# EAGLE design io_shield (EAGLE 9.6.2)
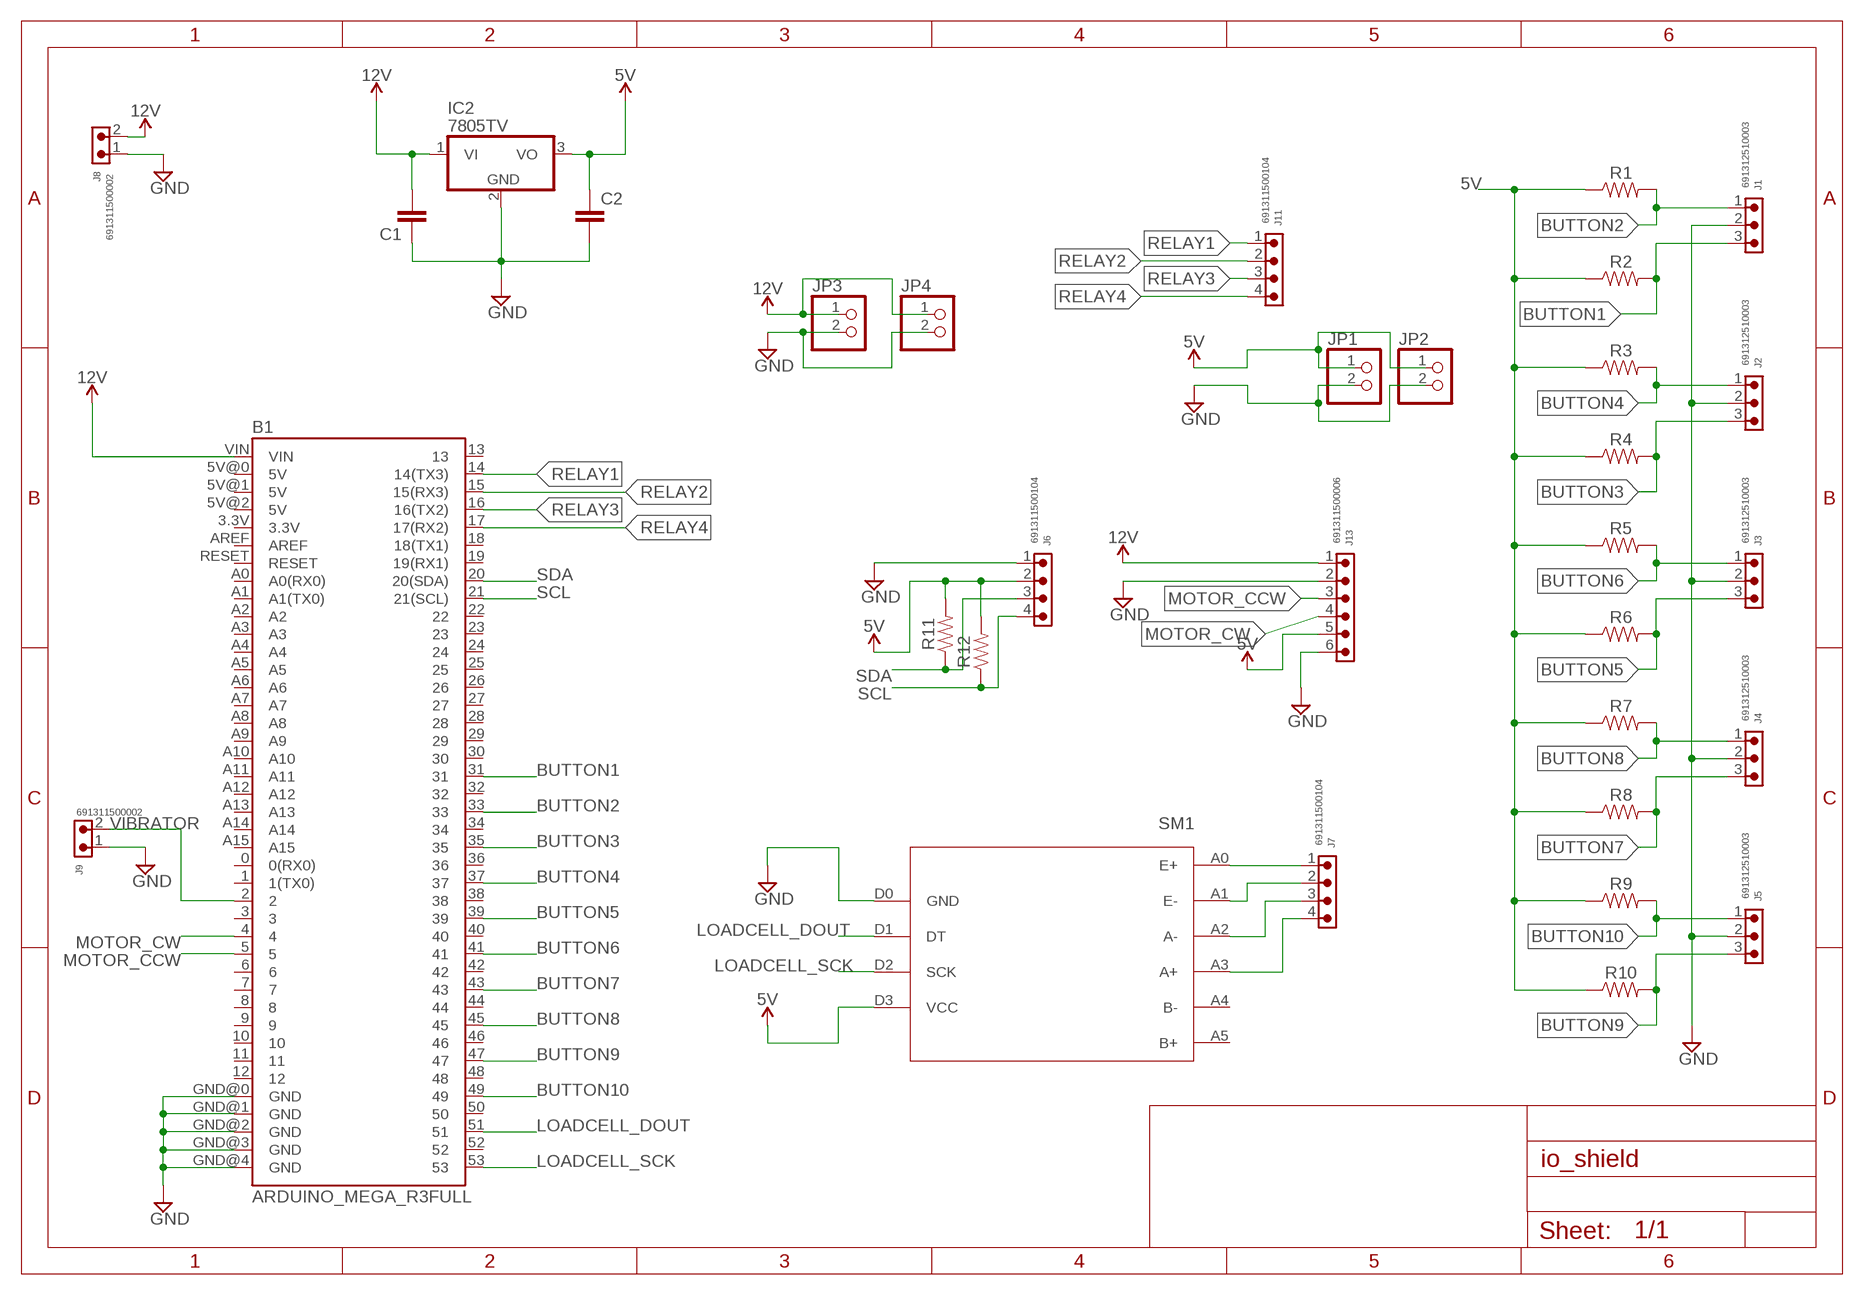
[diagram p0: schematic, sheet 1]

## Parts
B1  ARDUINO_MEGA_R3FULL  [ARDUINO_MEGA]
C1  C-EU050-025X075  [C050-025X075]
C2  C-EU050-025X075  [C050-025X075]
IC2  7805TV  [TO220V]
J1  691312510003  691312510003  [691312510003]
J2  691312510003  691312510003  [691312510003]
J3  691312510003  691312510003  [691312510003]
J4  691312510003  691312510003  [691312510003]
J5  691312510003  691312510003  [691312510003]
J6  691311500104  691311500104  [691311500104]
J7  691311500104  691311500104  [691311500104]
J8  691311500002  691311500002  [691311500002]
J9  691311500002  691311500002  [691311500002]
J11  691311500104  691311500104  [691311500104]
J13  691311500006  691311500006  [691311500006]
JP1  PINHD-1X2  [1X02]
JP2  PINHD-1X2  [1X02]
JP3  PINHD-1X2  [1X02]
JP4  PINHD-1X2  [1X02]
R1  RESISTORAXIAL-0.3  [AXIAL-0.3]
R2  RESISTORAXIAL-0.3  [AXIAL-0.3]
R3  RESISTORAXIAL-0.3  [AXIAL-0.3]
R4  RESISTORAXIAL-0.3  [AXIAL-0.3]
R5  RESISTORAXIAL-0.3  [AXIAL-0.3]
R6  RESISTORAXIAL-0.3  [AXIAL-0.3]
R7  RESISTORAXIAL-0.3  [AXIAL-0.3]
R8  RESISTORAXIAL-0.3  [AXIAL-0.3]
R9  RESISTORAXIAL-0.3  [AXIAL-0.3]
R10  RESISTORAXIAL-0.3  [AXIAL-0.3]
R11  RESISTORAXIAL-0.3  [AXIAL-0.3]
R12  RESISTORAXIAL-0.3  [AXIAL-0.3]
SM1  HX711  [HX711]

## Nets
5V: C2.1 IC2.3(VO) J6.2 J13.5 JP1.1 JP2.1 R1.P$1 R2.P$1 R3.P$1 R4.P$1 R5.P$1 R6.P$1 R7.P$1 R8.P$1 R9.P$1 R10.P$1 R11.P$2 R12.P$2 SM1.D3(VCC)
12V: B1.VIN C1.2 IC2.1(VI) J8.2 J13.1 JP3.1 JP4.1
A+: J7.4 SM1.A3(A+)
A-: J7.3 SM1.A2(A-)
BUTTON1: B1.31 J1.3 R2.P$2
BUTTON2: B1.33 J1.1 R1.P$2
BUTTON3: B1.35 J2.3 R4.P$2
BUTTON4: B1.37 J2.1 R3.P$2
BUTTON5: B1.39 J3.3 R6.P$2
BUTTON6: B1.41 J3.1 R5.P$2
BUTTON7: B1.43 J4.3 R8.P$2
BUTTON8: B1.45 J4.1 R7.P$2
BUTTON9: B1.47 J5.3 R10.P$2
BUTTON10: B1.49 J5.1 R9.P$2
E+: J7.1 SM1.A0(E+)
E-: J7.2 SM1.A1(E-)
GND: B1.GND@0(GND) B1.GND@1(GND) B1.GND@2(GND) B1.GND@3(GND) B1.GND@4(GND) C1.1 C2.2 IC2.2(GND) J1.2 J2.2 J3.2 J4.2 J5.2 J6.1 J8.1 J9.1 J13.2 J13.6 JP1.2 JP2.2 JP3.2 JP4.2 SM1.D0(GND)
LOADCELL_DOUT: B1.51 SM1.D1(DT)
LOADCELL_SCK: B1.53 SM1.D2(SCK)
MOTOR_CCW: B1.5 J13.3
MOTOR_CW: B1.4 J13.4
RELAY1: B1.14(14(TX3)) J11.1
RELAY2: B1.15(15(RX3)) J11.2
RELAY3: B1.16(16(TX2)) J11.3
RELAY4: B1.17(17(RX2)) J11.4
SCL: B1.21(21(SCL)) J6.4 R12.P$1
SDA: B1.20(20(SDA)) J6.3 R11.P$1
VIBRATOR: B1.2 J9.2
Unconnected: B1.0(0(RX0)) B1.1(1(TX0)) B1.3 B1.3.3V B1.5V@0(5V) B1.5V@1(5V) B1.5V@2(5V) B1.6 B1.7 B1.8 B1.9 B1.10 B1.11 B1.12 B1.13 B1.18(18(TX1)) B1.19(19(RX1)) B1.22 B1.23 B1.24 B1.25 B1.26 B1.27 B1.28 B1.29 B1.30 B1.32 B1.34 B1.36 B1.38 B1.40 B1.42 B1.44 B1.46 B1.48 B1.50 B1.52 B1.A0(A0(RX0)) B1.A1(A1(TX0)) B1.A2 B1.A3 B1.A4 B1.A5 B1.A6 B1.A7 B1.A8 B1.A9 B1.A10 B1.A11 B1.A12 B1.A13 B1.A14 B1.A15 B1.AREF B1.RESET SM1.A4(B-) SM1.A5(B+)

## Library data of the parts
B1 = SparkFun-Boards:ARDUINO_MEGA_R3: Arduino Mega R3 ATmega2560 R3 compatible footprint. SparkFun Products: Arduino Mega 2560 R3 <https://www.sparkfun.com/products/11061>
C1 C2 = rcl:C-EU: CAPACITOR, European symbol; SPICEPREFIX: C
IC2 = linear:78*: Positive VOLTAGE REGULATOR Source: http://cache.national.com/ds/LM/LM78L05.pdf http://www.fairchildsemi.com/ds/LM/LM7805.pdf
J1-J5 = Eagle_WR-TBL Pluggable Connector (rev20b) (1):691312510003: WR-TBL Serie 312 - 5.08 mm Open Horizontal PCB Header KIND PROPERTIES Pitch 5.08 mm MATERIAL PROPERTIES Insulator Material PBT Insulator Flammability Rating UL94 V-0 Contact Material Brass Contact Plating Tin GENERAL INFORMATION Operating Temperature -40 up to +105 °C Compliance RoHS ELECTRICAL PROPERTIES IR cULus 20 A IR VDE 20 A Working Voltage [cULus] 300 V (AC) Working Voltage [VDE] 300 V (AC) Withstanding Voltage [cULus] 1600 V (AC) Withstanding Voltage [VDE] 2500 V (AC) Contact Resistance [cULus] 20 mΩ Contact Resistance [VDE] 20 mΩ CERTIFICATION cULus Approval E315414 VDE Approval 40023195 <https://www.we-online.com/catalog/media/o33262v209%20Family_WR-TBL_6913125100xx.jpg> Details see: https://www.we-online.com/catalog/en/TBL_5_08_312_OPEN_HORIZONTAL_PCB_HEADER_6913125100XX/ Updated by Ella Wu 2019-12-26 2019(C) Wurth Elektronik; DATASHEET-URL: https://www.we-online.com/catalog/datasheet/691312510003.pdf; IR-UL: 20A; IR-VDE: 20A; MOUNT: THT; PART-NUMBER: 691312510003; PINS: 3; PITCH: 5.08mm; TYPE: Horizontal; WORKING-VOLTAGE-UL: 300V (AC); WORKING-VOLTAGE-VDE: 300V (AC)
J6 J7 J11 = Eagle_WR-TBL Pluggable Connector (rev20b) (1):691311500104: WR-TBL Serie 311 - 5.08 mm Close Vertical PCB Header KIND PROPERTIES Pitch 5.08 mm MATERIAL PROPERTIES Insulator Material PA66 Insulator Flammability Rating UL94 V-0 Insulator Color Green Contact Material Brass Contact Plating Tin GENERAL INFORMATION Operating Temperature -40 up to +105 °C ELECTRICAL PROPERTIES IR cULus 20 A IR VDE 20 A Working Voltage [cULus] 300 V (AC) Working Voltage [VDE] 300 V (AC) Withstanding Voltage [cULus] 1600 V (AC) Withstanding Voltage [VDE] 2500 V (AC) Contact Resistance [cULus] 20 mΩ Contact Resistance [VDE] 20 mΩ CERTIFICATION cULus Approval E315414 VDE Approval 40023195 <https://www.we-online.com/catalog/media/o33258v209%20Family_WR-TBL_6913115001xx.jpg> Details see: https://www.we-online.com/catalog/en/TBL_5_08_311_CLOSE_VERTICAL_PCB_HEADER_6913115001XX/ Updated by Ella Wu 2019-12-24 2019(C) Wurth Elektronik; DATASHEET-URL: https://www.we-online.com/catalog/datasheet/691311500104.pdf; IR-UL: 20A; IR-VDE: 20A; MOUNT: THT; PART-NUMBER: 691311500104; PINS: 4; PITCH: 5.08mm; TYPE: Vertical; WORKING-VOLTAGE-UL: 300V (AC); WORKING-VOLTAGE-VDE: 300V (AC)
J8 J9 = Eagle_WR-TBL Pluggable Connector (rev20b) (1):691311500002: WR-TBL Serie 311 - 5.08 mm Open Vertical PCB Header KIND PROPERTIES Pitch 5.08 mm MATERIAL PROPERTIES Insulator Material PBT Insulator Flammability Rating UL94 V-0 Contact Material Brass Contact Plating Tin GENERAL INFORMATION Operating Temperature -40 up to +105 °C ELECTRICAL PROPERTIES IR cULus 20 A IR VDE 20 A Working Voltage [cULus] 300 V (AC) Working Voltage [VDE] 300 V (AC) Withstanding Voltage [cULus] 1600 V (AC) Withstanding Voltage [VDE] 2500 V (AC) Contact Resistance [cULus] 20 mΩ Contact Resistance [VDE] 20 mΩ CERTIFICATION cULus Approval E315414 VDE Approval 40023195 <https://www.we-online.com/catalog/media/o33257v209%20Family_WR-TBL_6913115000xx.jpg> Details see: https://www.we-online.com/catalog/en/TBL_5_08_311_OPEN_VERTICAL_PCB_HEADER_6913115000XX/ Updated by Ella Wu 2019-12-25 2019(C) Wurth Elektronik; DATASHEET-URL: https://www.we-online.com/catalog/datasheet/691311500002.pdf; IR-UL: 20A; IR-VDE: 20A; MOUNT: THT; PART-NUMBER: 691311500002; PINS: 2; PITCH: 5.08mm; TYPE: Vertical; WORKING-VOLTAGE-UL: 300V (AC); WORKING-VOLTAGE-VDE: 300V (AC)
J13 = Eagle_WR-TBL Pluggable Connector (rev20b) (1):691311500006: WR-TBL Serie 311 - 5.08 mm Open Vertical PCB Header KIND PROPERTIES Pitch 5.08 mm MATERIAL PROPERTIES Insulator Material PBT Insulator Flammability Rating UL94 V-0 Contact Material Brass Contact Plating Tin GENERAL INFORMATION Operating Temperature -40 up to +105 °C ELECTRICAL PROPERTIES IR cULus 20 A IR VDE 20 A Working Voltage [cULus] 300 V (AC) Working Voltage [VDE] 300 V (AC) Withstanding Voltage [cULus] 1600 V (AC) Withstanding Voltage [VDE] 2500 V (AC) Contact Resistance [cULus] 20 mΩ Contact Resistance [VDE] 20 mΩ CERTIFICATION cULus Approval E315414 VDE Approval 40023195 <https://www.we-online.com/catalog/media/o33257v209%20Family_WR-TBL_6913115000xx.jpg> Details see: https://www.we-online.com/catalog/en/TBL_5_08_311_OPEN_VERTICAL_PCB_HEADER_6913115000XX/ Updated by Ella Wu 2019-12-25 2019(C) Wurth Elektronik; DATASHEET-URL: https://www.we-online.com/catalog/datasheet/691311500006.pdf; IR-UL: 20A; IR-VDE: 20A; MOUNT: THT; PART-NUMBER: 691311500006; PINS: 6; PITCH: 5.08mm; TYPE: Vertical; WORKING-VOLTAGE-UL: 300V (AC); WORKING-VOLTAGE-VDE: 300V (AC)
JP1-JP4 = pinhead:PINHD-1X2: PIN HEADER
R1-R12 = SparkFun-Resistors:RESISTOR: Generic Resistor Package
SM1 = hx711:HX711: HX711 module is a Load Cell Amplifier breakout board for the HX711 IC that allows you to easily read load cells to measure weight. This module uses 24 high precision A/D converter chip HX711. It is a specially designed for the high precision electronic scale design, with two analog input channel, the internal integration of 128 times the programmable gain amplifier. The input circuit can be configured to provide a bridge type pressure bridge (such as pressure, weighing sensor mode), is of high precision, low cost is an ideal sampling front-end module.

## Board
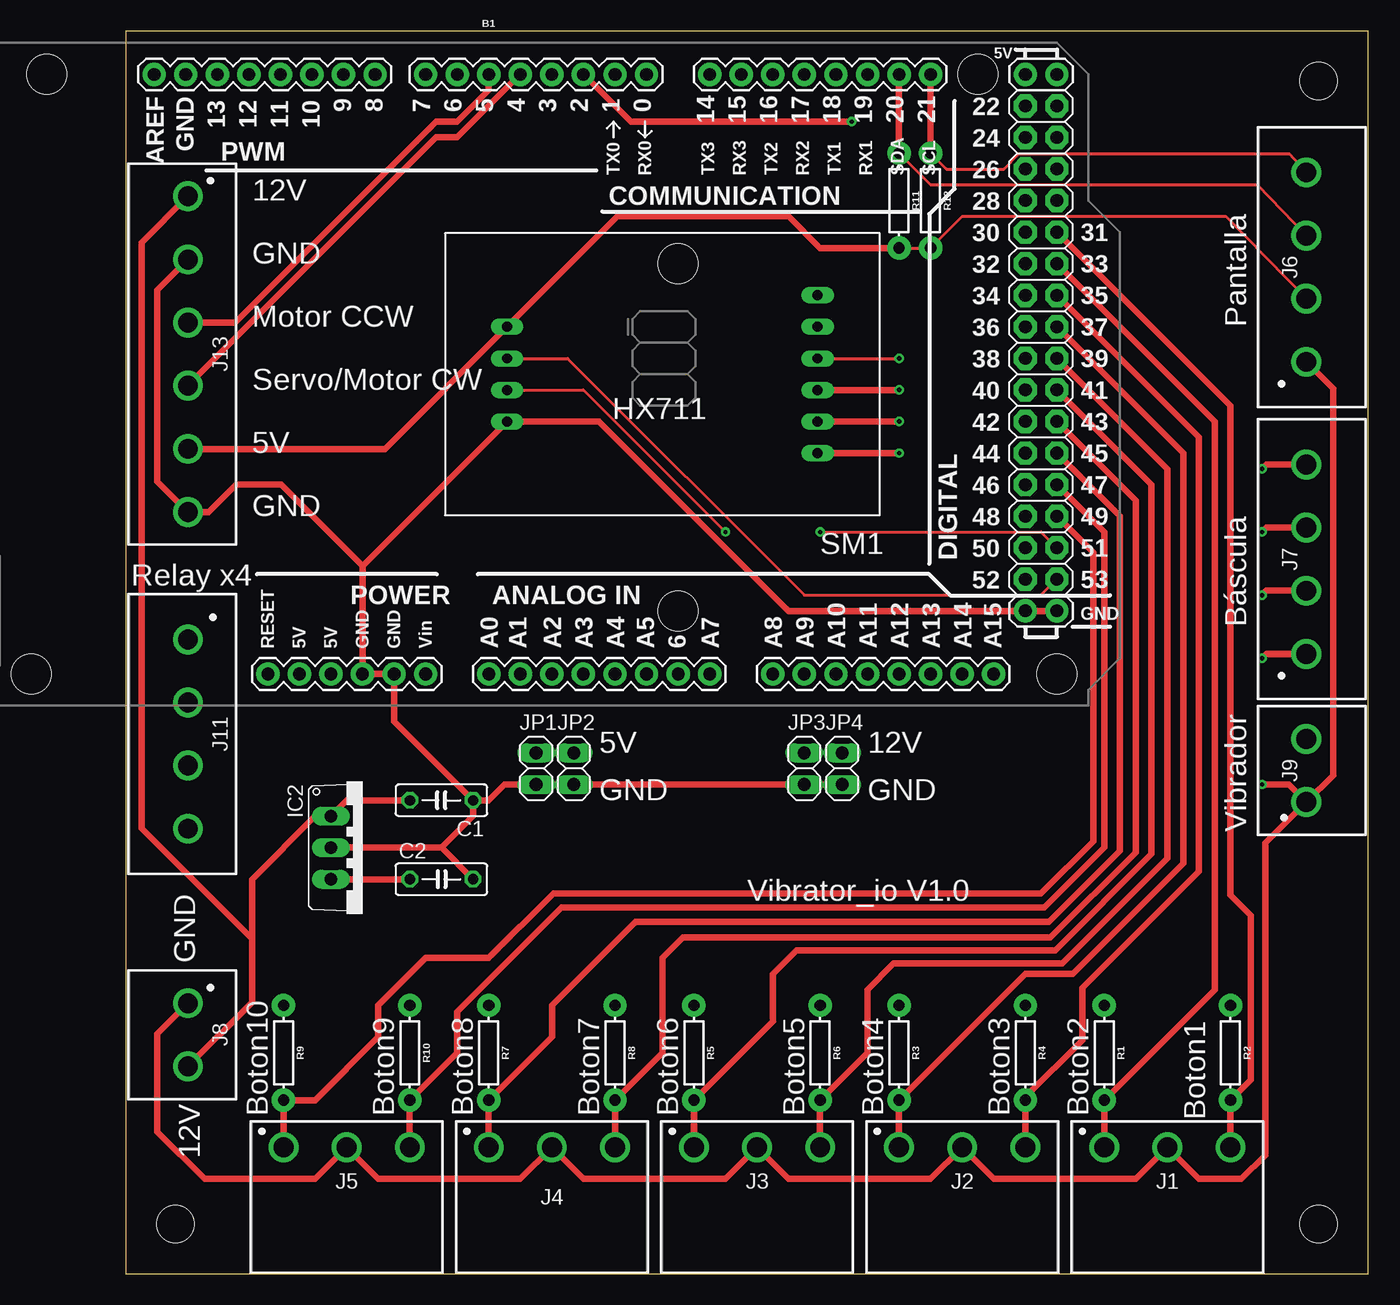
[diagram p1: board, top side]
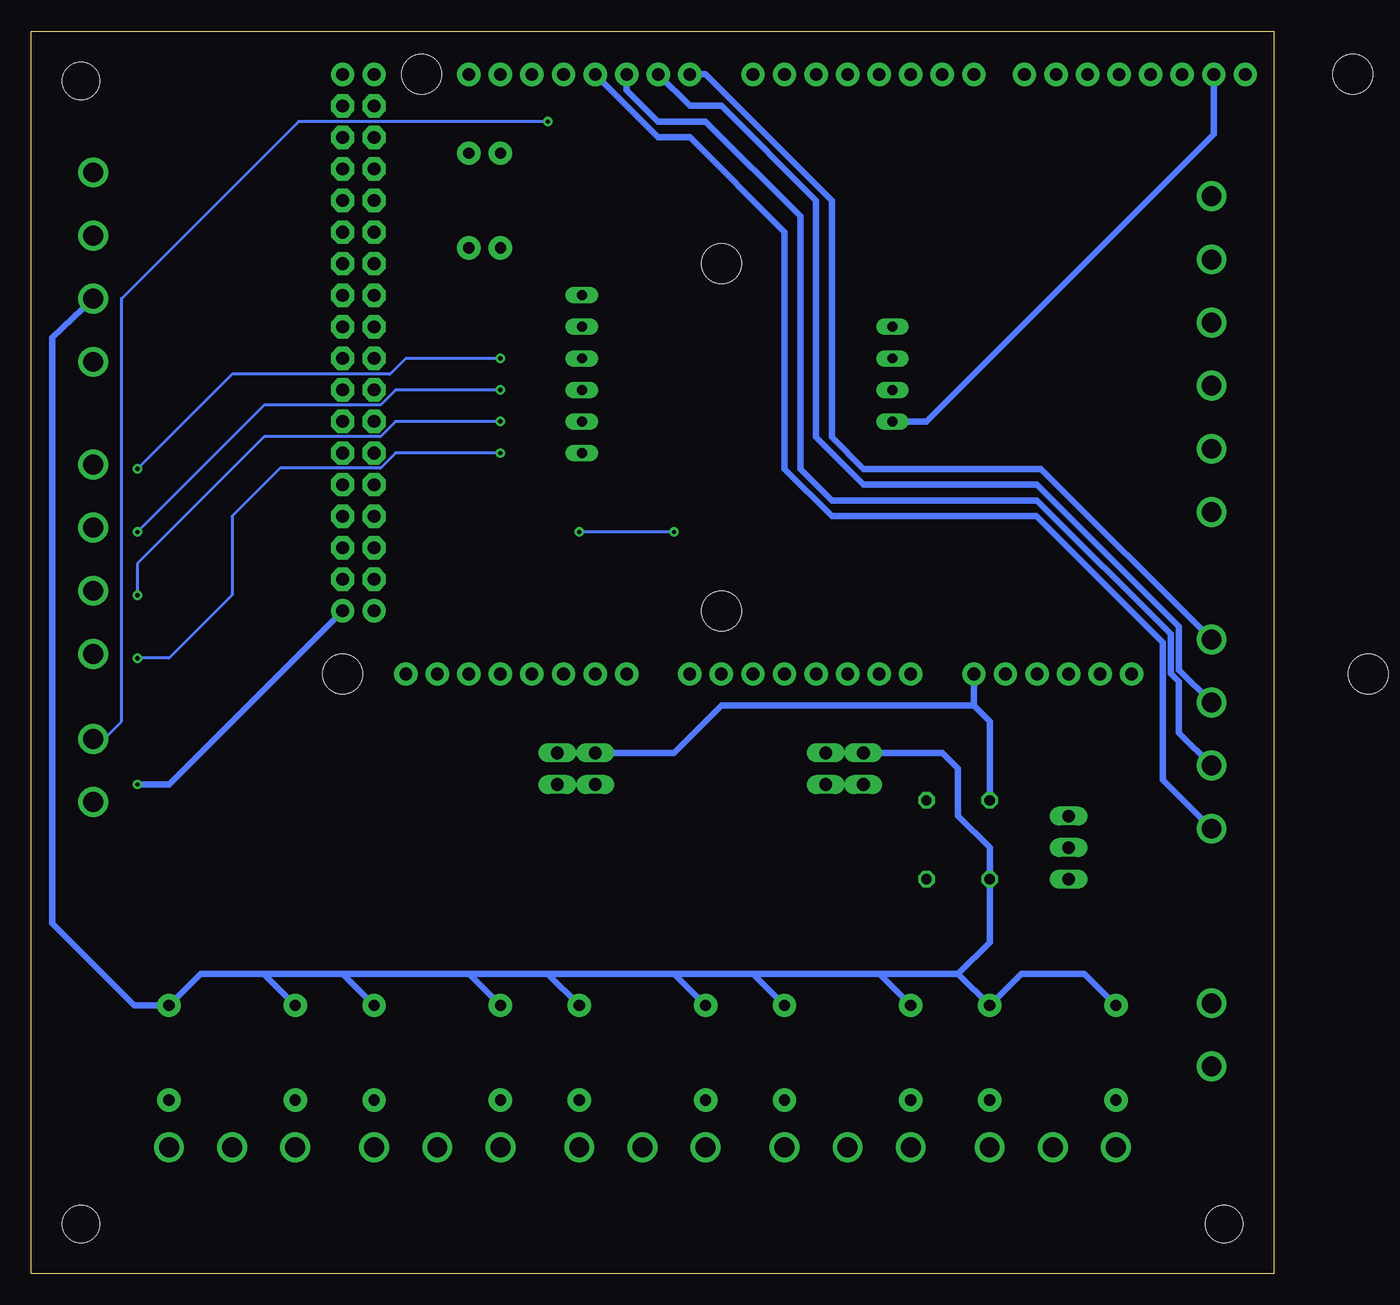
[diagram p2: board, bottom side, seen from below]

Size 100 x 100 mm. Coordinates in mm from the lower left corner, seen from the top.
Outline: 0,0 100,0 100,100 0,100 0,0
Copper layers (1*16): Top 0.035mm / dielectric 1.5mm / Bottom 0.035mm
Design rules "default": minimum track width 6mil, minimum drill 0.35mm, track to track 6mil, track to pad 6mil, pad to pad 6mil, via to via 6mil, smd to smd 6mil, copper to edge 40mil, drill to drill 6mil, minimum pad ring 10mil, minimum via ring 8mil, stop-mask expansion 4mil, vias tented up to drill 0mil, thermal gap 10mil
Holes 3 mm at 96,4 4,4 96,96

### Footprints (pad centres in the part's own frame; a part is rotated, then mirrored left to right if it is on the bottom)
ARDUINO_MEGA = drill 1.016 pad 1.88: 0 13.97,24.13; 1 11.43,24.13; 2 8.89,24.13; 3 6.35,24.13; 3.3V -13.97,-24.13; 4 3.81,24.13; 5 1.27,24.13; 5V@0 -11.43,-24.13; 5V@1 44.45,24.13; 5V@2 46.99,24.13; 6 -1.27,24.13; 7 -3.81,24.13; 8 -7.874,24.13; 9 -10.414,24.13; 10 -12.954,24.13; 11 -15.494,24.13; 12 -18.034,24.13; 13 -20.574,24.13; 14 19.05,24.13; 15 21.59,24.13; 16 24.13,24.13; 17 26.67,24.13; 18 29.21,24.13; 19 31.75,24.13; 20 34.29,24.13; 21 36.83,24.13; A0 1.27,-24.13; A1 3.81,-24.13; A2 6.35,-24.13; A3 8.89,-24.13; A4 11.43,-24.13; A5 13.97,-24.13; A6 16.51,-24.13; A7 19.05,-24.13; A8 24.13,-24.13; A9 26.67,-24.13; A10 29.21,-24.13; A11 31.75,-24.13; A12 34.29,-24.13; A13 36.83,-24.13; A14 39.37,-24.13; A15 41.91,-24.13; AREF -25.654,24.13; GND@0 -8.89,-24.13; GND@1 -6.35,-24.13; GND@2 44.45,-19.05; GND@3 46.99,-19.05; GND@4 -23.114,24.13; RESET -16.51,-24.13; VIN -3.81,-24.13 | drill 1.016 pad 1.88 octagon: 22 44.45,21.59; 23 46.99,21.59; 24 44.45,19.05; 25 46.99,19.05; 26 44.45,16.51; 27 46.99,16.51; 28 44.45,13.97; 29 46.99,13.97; 30 44.45,11.43; 31 46.99,11.43; 32 44.45,8.89; 33 46.99,8.89; 34 44.45,6.35; 35 46.99,6.35; 36 44.45,3.81; 37 46.99,3.81; 38 44.45,1.27; 39 46.99,1.27; 40 44.45,-1.27; 41 46.99,-1.27; 42 44.45,-3.81; 43 46.99,-3.81; 44 44.45,-6.35; 45 46.99,-6.35; 46 44.45,-8.89; 47 46.99,-8.89; 48 44.45,-11.43; 49 46.99,-11.43; 50 44.45,-13.97; 51 46.99,-13.97; 52 44.45,-16.51; 53 46.99,-16.51 | hole 3.2: -34.29,24.13; -35.56,-24.13; 16.51,8.89; 16.51,-19.05; 40.64,24.13; 46.99,-24.13
C050-025X075 = drill 0.813 octagon: 1 -2.54,0; 2 2.54,0
TO220V = drill 1.016 long: 1 -2.54,-2.54; 2 0,-2.54; 3 2.54,-2.54
691312510003 = drill 1.6: 1 -5.08,0; 2 0,0; 3 5.08,0
691311500104 = drill 1.6: 1 -7.62,0; 2 -2.54,0; 3 2.54,0; 4 7.62,0
691311500002 = drill 1.6: 1 -2.54,0; 2 2.54,0
691311500006 = drill 1.6: 1 -12.7,0; 2 -7.62,0; 3 -2.54,0; 4 2.54,0; 5 7.62,0; 6 12.7,0
1X02 = drill 1.016 long: 1 -1.27,0; 2 1.27,0
AXIAL-0.3 = drill 0.9 pad 1.88: P$1 -3.81,0; P$2 3.81,0
HX711 = drill 0.8 long: A0 -12.5,6.35; A1 -12.5,3.81; A2 -12.5,1.27; A3 -12.5,-1.27; A4 -12.5,-3.81; A5 -12.5,-6.35; D0 12.5,3.81; D1 12.5,1.27; D2 12.5,-1.27; D3 12.5,-3.81

### Placement (x,y rotation side)
B1  27.94,72.39 0 top
C1  25.4,38.1 180 top
C2  25.4,31.75 0 top
IC2  19.05,34.29 270 top
J1  83.82,10.16 0 top
J2  67.31,10.16 0 top
J3  50.8,10.16 0 top
J4  34.29,10.16 0 top
J5  17.78,10.16 0 top
J6  95,81 90 top
J7  95,57.5 90 top
J8  5,19.23 270 top
J9  95,40.5 90 top
J11  5,43.43 270 top
J13  5,74 270 top
JP1  33.02,40.64 270 top
JP2  36.07,40.64 270 top
JP3  54.61,40.64 270 top
JP4  57.66,40.64 270 top
R1  78.74,17.78 270 top
R2  88.9,17.78 270 top
R3  62.23,17.78 270 top
R4  72.39,17.78 270 top
R5  45.72,17.78 270 top
R6  55.88,17.78 270 top
R7  29.21,17.78 270 top
R8  39.37,17.78 270 top
R9  12.7,17.78 270 top
R10  22.86,17.78 270 top
R11  62.23,86.36 270 top
R12  64.77,86.36 270 top
SM1  43.18,72.39 180 top

### Tracks (layer width: path | path; a pad name or v marks a point on that pad's centre or on a via)
5V
  Top 0.254: R11.P$2 R12.P$2 67.31,85.09 88.52,85.09 J6.2
  Top 0.508: R11.P$2 55.88,82.55 53.34,85.09 39.57,85.09 SM1.D3 20.86,66.38 J13.5 | IC2.3 C2.1 | JP1.1 JP2.1
  Bottom 0.508: J6.2 98.3,75.34 98.3,28.19 91.69,21.59 R2.P$1 86.36,24.13 81.28,24.13 | JP1.1 26.67,41.91 25.4,40.64 25.4,36.83 22.86,34.29 C2.1 22.86,26.67 25.4,24.13 | 81.28,24.13 74.93,24.13 | 74.93,24.13 64.77,24.13 | 64.77,24.13 58.42,24.13 | 58.42,24.13 48.26,24.13 | 48.26,24.13 41.91,24.13 | 41.91,24.13 31.75,24.13 | 31.75,24.13 25.4,24.13 | 25.4,24.13 R10.P$1 20.32,24.13 15.24,24.13 R9.P$1 | R7.P$1 31.75,24.13 | R8.P$1 41.91,24.13 | R5.P$1 48.26,24.13 | R6.P$1 58.42,24.13 | R3.P$1 64.77,24.13 | R4.P$1 74.93,24.13 | R1.P$1 81.28,24.13
12V
  Top 0.508: J8.2 10.16,21.85 10.16,26.92 | 10.16,26.92 10.16,31.75 15.24,36.83 IC2.1 17.78,38.1 C1.2 | J13.1 1.27,82.97 1.27,35.81 10.16,26.92
  Bottom 0.508: 24.13,45.72 22.86,44.45 C1.2 | 24.13,45.72 B1.VIN | 24.13,45.72 44.45,45.72 48.26,41.91 JP3.1 JP4.1
A+  (via drill 0.35)
  Top 0.254: SM1.A3 v62.23,73.66
  Top 0.508: J7.4 91.79,65.12 v91.44,64.77
  Bottom 0.254: v62.23,73.66 69.85,73.66 71.12,72.39 83.82,72.39 v91.44,64.77
A-  (via drill 0.35)
  Top 0.508: SM1.A2 v62.23,71.12 | J7.3 91.79,60.04 v91.44,59.69
  Bottom 0.254: v62.23,71.12 70.67,71.12 71.89,69.9 81.23,69.9 v91.44,59.69
BUTTON1
  Top 0.508: B1.31 88.9,69.85 88.9,30.48 90.55,28.83 90.55,15.62 R2.P$2 J1.3
BUTTON2
  Top 0.508: B1.33 87.63,68.58 87.63,22.86 R1.P$2 J1.1
BUTTON3
  Top 0.508: B1.35 86.36,67.31 86.36,32.38 76.96,22.99 76.96,18.8 72.39,14.22 R4.P$2 J2.3
BUTTON4
  Top 0.508: B1.37 85.09,66.04 85.09,33.02 76.2,24.13 72.39,24.13 R3.P$2 J2.1
BUTTON5
  Top 0.508: B1.39 83.82,64.77 83.82,33.4 75.37,24.96 61.78,24.96 59.69,22.86 59.69,17.78 R6.P$2 J3.3
BUTTON6
  Top 0.508: B1.41 82.55,63.5 82.55,33.78 74.8,26.04 53.98,26.04 52.07,24.13 52.07,20.32 R5.P$2 J3.1
BUTTON7
  Top 0.508: B1.43 81.28,62.23 81.28,33.91 74.42,27.05 44.83,27.05 43.18,25.4 43.18,17.78 R8.P$2 J4.3
BUTTON8
  Top 0.508: B1.45 80.01,60.96 80.01,34.04 74.3,28.32 41.02,28.32 34.29,21.59 34.29,19.05 R7.P$2 J4.1
BUTTON9
  Top 0.508: B1.47 78.74,59.69 78.74,34.29 73.91,29.46 35.05,29.46 26.67,21.08 26.67,17.78 R10.P$2 J5.3
BUTTON10
  Top 0.508: B1.49 77.85,58.04 77.85,34.8 73.66,30.61 34.42,30.61 29.21,25.4 24.13,25.4 20.32,21.59 20.32,19.05 15.24,13.97 R9.P$2 J5.1
E+  (via drill 0.35)
  Top 0.508: SM1.A0 v62.23,66.04 | J7.1 91.79,49.88 v91.44,49.53
  Bottom 0.254: v62.23,66.04 70.67,66.04 71.89,64.82 79.96,64.82 83.82,60.96 83.82,54.61 88.9,49.53 v91.44,49.53
E-  (via drill 0.35)
  Top 0.508: SM1.A1 v62.23,68.58 | J7.2 91.79,54.96 v91.44,54.61
  Bottom 0.254: v62.23,68.58 70.67,68.58 71.89,67.36 81.23,67.36 91.44,57.15 v91.44,54.61
GND  (via drill 0.35)
  Top 0.508: B1.GND@3 B1.GND@2 53.34,53.34 38.1,68.58 SM1.D0 19.05,56.95 | v91.44,39.37 93.59,39.37 J9.1 | J9.1 91.7,34.66 91.7,9.53 89.79,7.62 86.36,7.62 J1.2 81.28,7.62 69.85,7.62 J2.2 64.77,7.62 53.34,7.62 J3.2 48.26,7.62 36.83,7.62 J4.2 31.75,7.62 20.32,7.62 J5.2 15.24,7.62 6.35,7.62 2.54,11.43 2.54,19.31 J8.1 | J9.1 97.16,40.12 97.16,71.22 J6.1 | IC2.2 25.4,34.29 | 25.4,34.29 C2.2 | 25.4,34.29 27.94,36.83 C1.1 | C1.1 29.21,38.1 30.48,39.37 JP1.2 JP2.2 JP3.2 JP4.2 | C1.1 21.59,44.45 B1.GND@1 B1.GND@0 19.05,56.95 | 19.05,56.95 12.5,63.5 8.89,63.5 6.69,61.3 J13.6 2.54,63.76 2.54,79.16 J13.2
  Bottom 0.508: v91.44,39.37 88.9,39.37 B1.GND@3 | SM1.D0 27.94,68.58 4.83,91.69 B1.GND@4
LOADCELL_DOUT  (via drill 0.35)
  Top 0.254: SM1.D1 36.83,71.12 v48.26,59.69 | v55.88,59.69 73.66,59.69 B1.51
  Bottom 0.254: v48.26,59.69 v55.88,59.69
LOADCELL_SCK
  Top 0.254: SM1.D2 35.56,73.66 54.61,54.61 73.66,54.61 B1.53
MOTOR_CCW
  Top 0.508: B1.5 29.21,95.25 26.67,92.71 24.98,92.71 8.81,76.54 J13.3
MOTOR_CW
  Top 0.508: B1.4 26.67,91.44 25.4,91.44 24.98,91.44 J13.4
RELAY1
  Bottom 0.508: J11.1 18.72,64.77 33.02,64.77 35.56,67.31 35.56,86.36 45.72,96.52 B1.14
RELAY2
  Bottom 0.508: J11.2 7.62,48.59 7.62,52.07 19.05,63.5 33.02,63.5 36.83,67.31 36.83,86.36 44.45,93.98 46.99,93.98 B1.15
RELAY3
  Bottom 0.508: J11.3 7.62,43.51 7.62,47.66 8.28,48.32 8.28,51.46 19.05,62.23 35.56,62.23 38.1,64.77 38.1,85.09 45.72,92.71 49.53,92.71 52.07,95.25 B1.16
RELAY4
  Bottom 0.508: J11.4 8.94,39.75 8.94,50.8 19.1,60.96 35.56,60.96 39.37,64.77 39.37,83.82 46.99,91.44 49.53,91.44 B1.17
SCL
  Top 0.254: R12.P$1 66.04,88.9 70.67,88.9 71.89,90.12 93.65,90.12 J6.4
  Top 0.508: B1.21 R12.P$1
SDA
  Top 0.254: R11.P$1 64.77,87.63 91.06,87.63 J6.3
  Top 0.508: B1.20 R11.P$1
VIBRATOR  (via drill 0.35)
  Top 0.508: B1.2 40.64,92.71 v58.42,92.71
  Bottom 0.254: v58.42,92.71 78.49,92.71 92.71,78.49 92.71,44.45 94.12,43.04 J9.2

### Text on the board
tPlace: 12V | GND | Motor CCW | Pantalla | Servo/Motor CW | 5V | GND | Relay x4 | Báscula | 5V | 12V | GND | GND | Vibrador | Vibrator_io V1.0 | GND | Boton1 | Boton10 | Boton9 | Boton8 | Boton7 | Boton6 | Boton5 | Boton4 | Boton3 | Boton2 | 12V